# EAGLE design controllercap (EAGLE 7.7.0)
CNAME: timebox controller; CREVISION: 1.0; DESIGNER: volzo
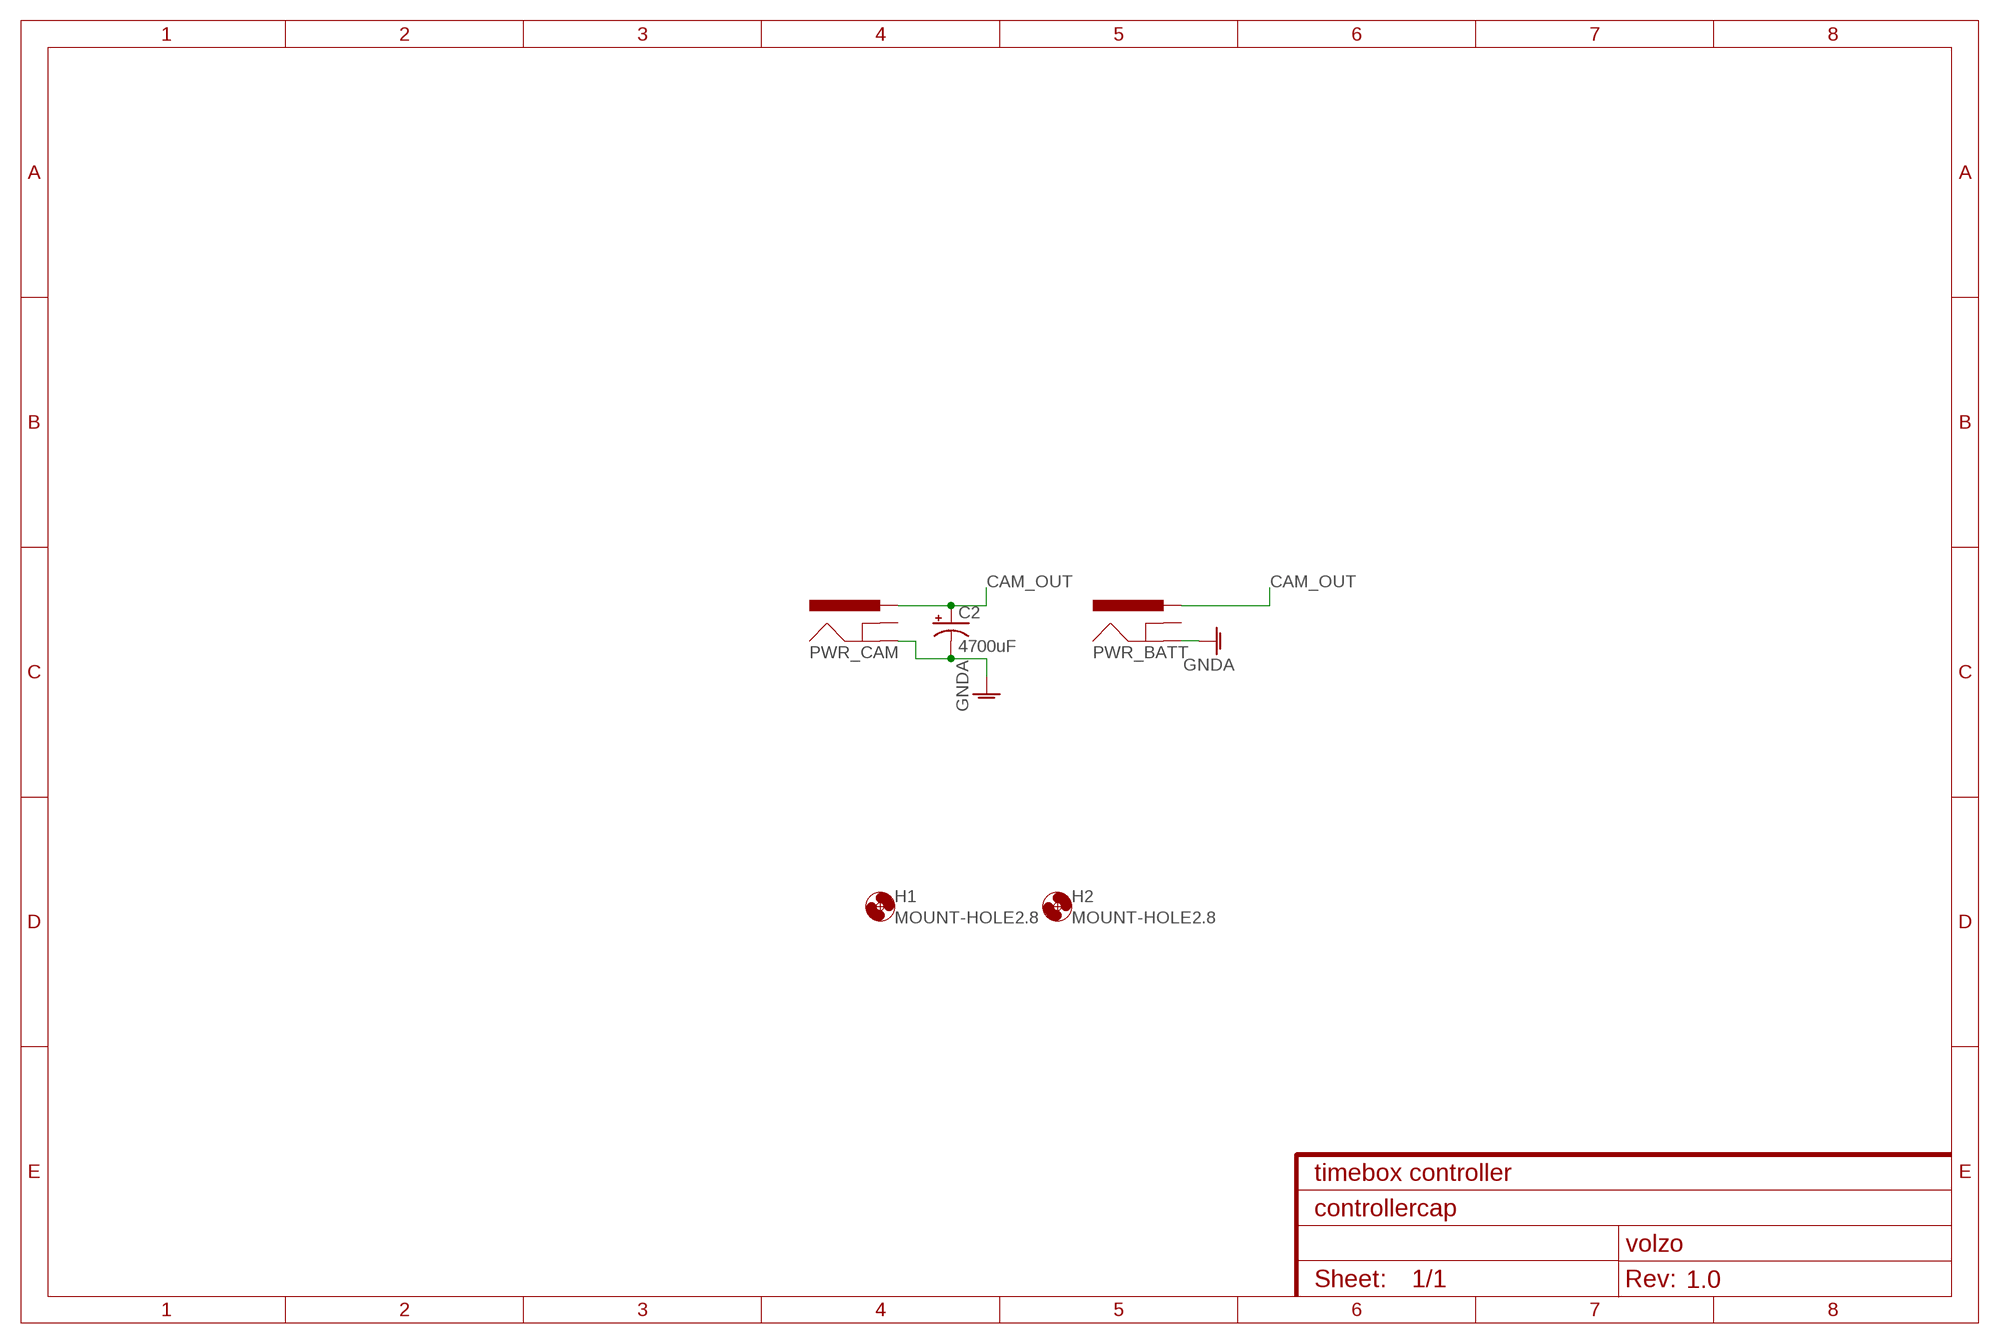
[diagram p0: schematic, sheet 1]

## Parts
C2  4700uF  CAP_POLPTH3  [CPOL-RADIAL-1000UF-63V]
H1  MOUNT-HOLE2.8  [2,8]
H2  MOUNT-HOLE2.8  [2,8]
PWR_BATT  POWER_JACKPTH_BREAD  [POWER_JACK_PTH_BREAD]
PWR_CAM  POWER_JACKPTH_BREAD  [POWER_JACK_PTH_BREAD]

## Nets
CAM_OUT [power]: C2.1(+) PWR_BATT.PWR PWR_CAM.PWR
GNDA [power]: C2.2(-) PWR_BATT.GND PWR_CAM.GND
Unconnected: PWR_BATT.GNDBREAK PWR_CAM.GNDBREAK

## Library data of the parts
C2 = SparkFun-Passives:CAP_POL: Capacitor Polarized These are standard SMD and PTH capacitors. Normally 10uF, 47uF, and 100uF in electrolytic and tantalum varieties. Always verify the external diameter of the through hole cap, it varies with capacity, voltage, and manufacturer. The EIA devices should be standard.
H1 H2 = holes:MOUNT-HOLE: MOUNTING HOLE with drill center marker
PWR_BATT PWR_CAM = SparkFun-Connectors:POWER_JACK: Power Jack This is the standard 5.5mm barrel jack for power. The PTH is the most common, proven, reliable, footprint. The Slot footprint only works if the mill layer is transmitted to the PCB fab house so be warned. Mating wall wart : TOL-00298 (and others); PROD_ID: PRT-10811

## Net classes
0 default: width 0.254 mm
1 power: width 0.762 mm, clearance 0.254 mm

## Board
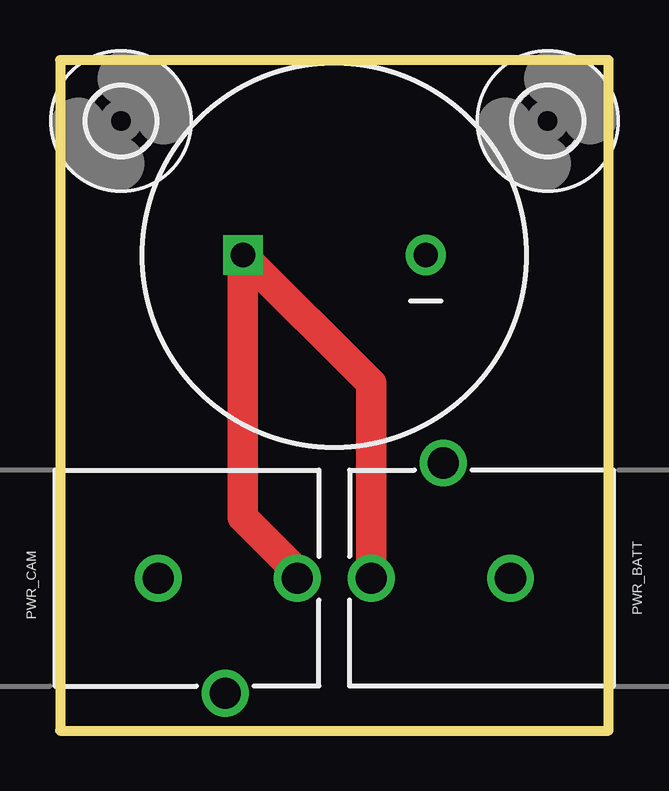
[diagram p1: board, top side]
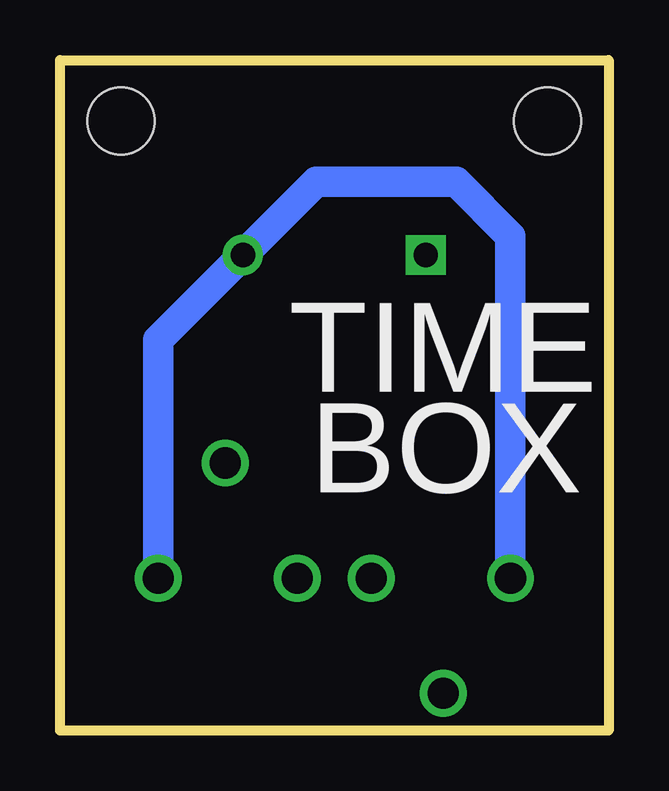
[diagram p2: board, bottom side, seen from below]

Size 22.86 x 27.94 mm. Coordinates in mm from the lower left corner, seen from the top.
Outline: 0,0 22.86,0 22.86,27.94 0,27.94 0,0
Copper layers (1*16): Top 0.0356mm / dielectric 1.5011mm / Bottom 0.0356mm
Design rules "oshpark-2layer *": minimum track width 6mil, minimum drill 13mil, track to track 10mil, track to pad 10mil, pad to pad 10mil, via to via 10mil, smd to smd 10mil, copper to edge 15mil, drill to drill 6mil, minimum pad ring 7mil, minimum via ring 7mil, stop-mask expansion 2.5mil, vias tented up to drill 0mil, thermal gap 10mil

### Footprints (pad centres in the part's own frame; a part is rotated, then mirrored left to right if it is on the bottom)
CPOL-RADIAL-1000UF-63V = drill 1.016 pad 1.651 square: 1 3.81,0 | drill 1.016 pad 1.676: 2 -3.81,0
2,8 = hole 2.8: 0,0
POWER_JACK_PTH_BREAD = drill 1.3: GND 0,7.9; GNDBREAK 4.8,10.7; PWR 0,13.7

### Placement (x,y rotation side)
C2  11.43,19.81 180 top
H1  2.54,25.4 0 top
H2  20.32,25.4 0 top
PWR_BATT  26.67,6.35 90 top
PWR_CAM  -3.81,6.35 270 top

### Tracks (layer width: path | path; a pad name or v marks a point on that pad's centre or on a via)
CAM_OUT
  Top 1.27: PWR_BATT.PWR 12.97,14.46 C2.1 7.62,8.89 9.89,6.62 PWR_CAM.PWR
GNDA
  Bottom 1.27: PWR_BATT.GND 18.77,16.28 C2.2 12.19,22.86 6.35,22.86 4.09,20.6 PWR_CAM.GND

### Text on the board
bPlace: TIME | BOX